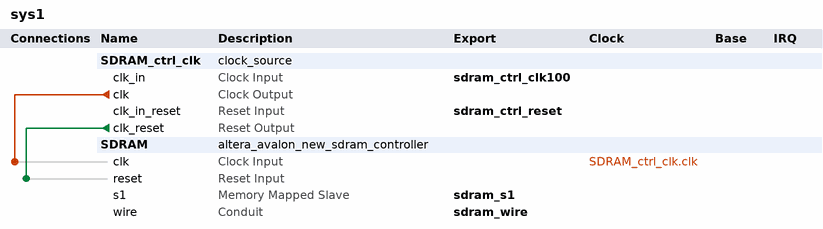
[diagram p0: system contents]
# Platform Designer (Qsys) system sys1, MAX 10 10M50DAF484C7G
# Parameters at their usual value, and those the tool derives, are not listed.
package require -exact qsys 18.1
create_system sys1
set_project_property DEVICE_FAMILY {MAX 10}
set_project_property DEVICE 10M50DAF484C7G

add_instance SDRAM_ctrl_clk clock_source 18.1
set_instance_parameter_value SDRAM_ctrl_clk clockFrequency 100000000

add_instance SDRAM altera_avalon_new_sdram_controller 18.1
set_instance_parameter_value SDRAM TAC 5.4
set_instance_parameter_value SDRAM TMRD 2
set_instance_parameter_value SDRAM TRCD 15.0
set_instance_parameter_value SDRAM TRP 15.0
set_instance_parameter_value SDRAM casLatency 3
set_instance_parameter_value SDRAM columnWidth 10
set_instance_parameter_value SDRAM dataWidth 16
set_instance_parameter_value SDRAM generateSimulationModel true
set_instance_parameter_value SDRAM model single_Micron_MT48LC4M32B2_7_chip
set_instance_parameter_value SDRAM numberOfBanks 4
set_instance_parameter_value SDRAM numberOfChipSelects 1
set_instance_parameter_value SDRAM powerUpDelay 100.0
set_instance_parameter_value SDRAM refreshPeriod 7.8125
set_instance_parameter_value SDRAM rowWidth 13

# connections
add_connection SDRAM_ctrl_clk.clk SDRAM.clk clock
add_connection SDRAM_ctrl_clk.clk_reset SDRAM.reset reset

# exported interfaces
add_interface sdram_ctrl_clk100 clock sink
set_interface_property sdram_ctrl_clk100 EXPORT_OF SDRAM_ctrl_clk.clk_in
add_interface sdram_ctrl_reset reset sink
set_interface_property sdram_ctrl_reset EXPORT_OF SDRAM_ctrl_clk.clk_in_reset
add_interface sdram_s1 avalon slave
set_interface_property sdram_s1 EXPORT_OF SDRAM.s1
add_interface sdram_wire conduit end
set_interface_property sdram_wire EXPORT_OF SDRAM.wire

set_interconnect_requirement {$system} qsys_mm.clockCrossingAdapter HANDSHAKE
set_interconnect_requirement {$system} qsys_mm.enableEccProtection FALSE
set_interconnect_requirement {$system} qsys_mm.insertDefaultSlave FALSE
set_interconnect_requirement {$system} qsys_mm.maxAdditionalLatency 1

save_system sys1.qsys
